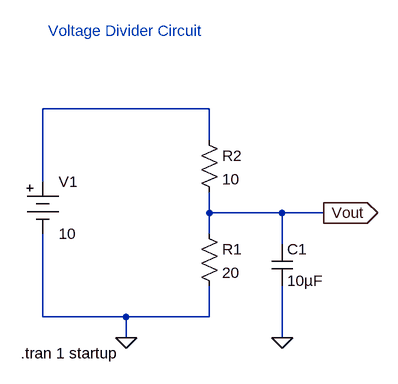
[diagram p0: schematic 1. Voltage Divider.asc]
1. Voltage Divider.asc, the LTspice schematic file:
Version 4
SHEET 1 880 680
WIRE 256 16 0 16
WIRE 256 64 256 16
WIRE 0 128 0 16
WIRE 256 176 256 144
WIRE 368 176 256 176
WIRE 432 176 368 176
WIRE 256 208 256 176
WIRE 368 224 368 176
WIRE 0 336 0 208
WIRE 128 336 0 336
WIRE 256 336 256 288
WIRE 256 336 128 336
WIRE 128 368 128 336
WIRE 368 368 368 288
FLAG 432 176 Vout
IOPIN 432 176 Out
FLAG 128 368 0
FLAG 368 368 0
SYMBOL res 240 192 R0
SYMATTR InstName R1
SYMATTR Value 20
SYMBOL res 240 48 R0
SYMATTR InstName R2
SYMATTR Value 10
SYMBOL Misc\\battery 0 112 R0
WINDOW 123 0 0 Left 0
WINDOW 39 0 0 Left 0
SYMATTR InstName V1
SYMATTR Value 10
SYMBOL cap 352 224 R0
SYMATTR InstName C1
SYMATTR Value 10µF
TEXT 8 -104 Left 2 ;Voltage Divider Circuit
TEXT -34 392 Left 2 !.tran 1 startup

The netlist it stands for:
* 1. Voltage Divider.asc
R1 Vout 0 20
R2 N001 Vout 10
V1 N001 0 10
C1 Vout 0 10µF
* Voltage Divider Circuit
.tran 1 startup
.backanno
.end